# Altium project BeagleBone-AI.PrjPcb (part 5 of 5)
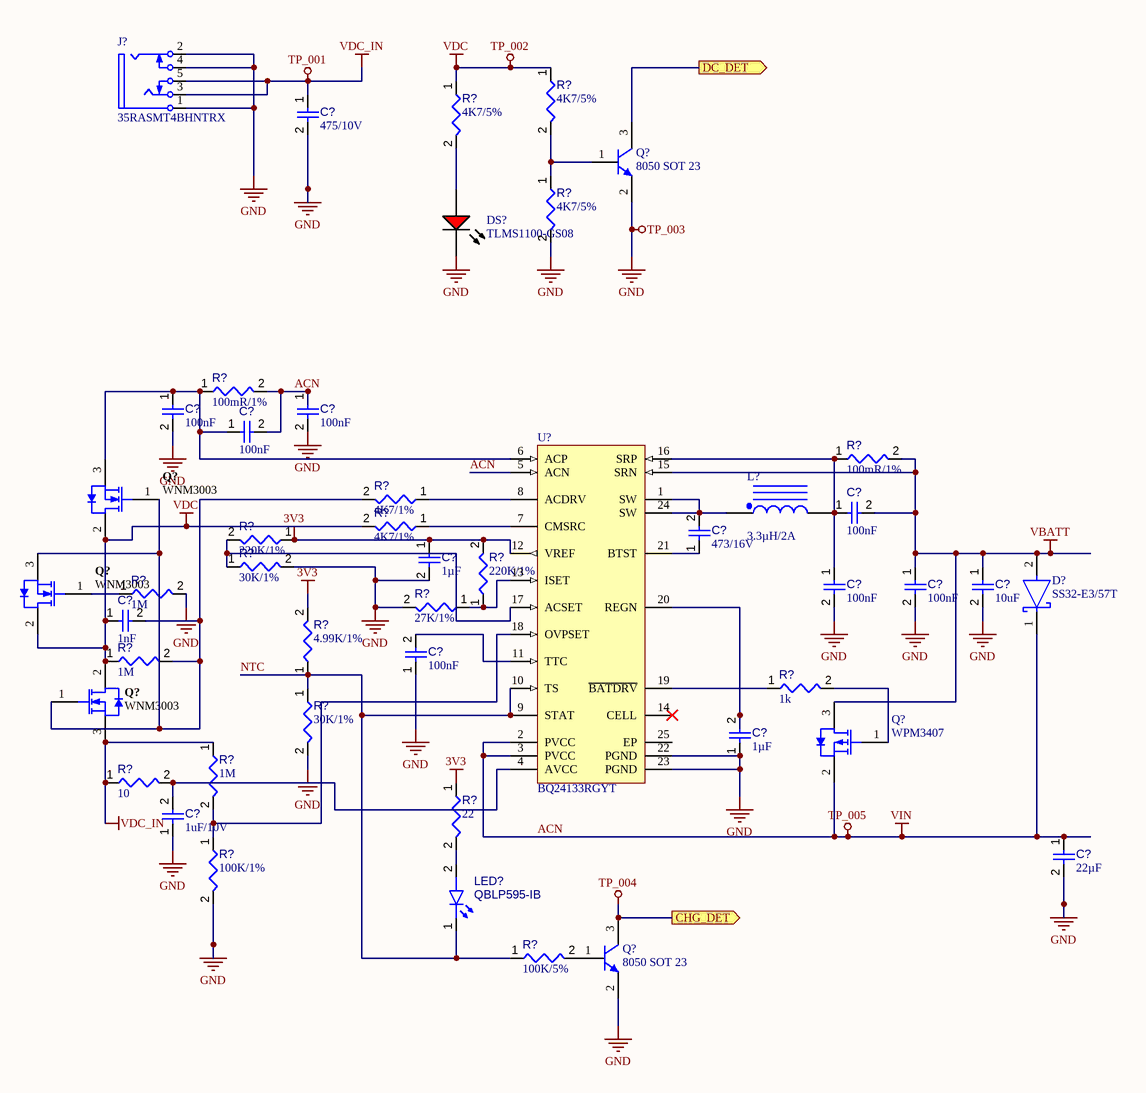
[diagram p24: BMS_Circuit.SchDoc]

## Nets that join several sheets
1V8_PHY_HDMI: 12 Processor  Power (U4.Y17), 13 Processor Power Deco (C159.1)
1V8_PHY_LDO3: 03 PMIC1 (C121.1 U3.K11), 13 Processor Power Deco (FL1.1)
1V8_PHY_LDO4: 03 PMIC1 (C117.1 U3.K12), 13 Processor Power Deco (FB6.1)
1V8_PHY_PCIE: 12 Processor  Power (U4.AA16 U4.AA17 U4.W14), 13 Processor Power Deco (C116.1 C149.1 FB6.2)
1V8_PHY_SATA: 12 Processor  Power (U4.V13), 13 Processor Power Deco (C184.1)
1V8_PHY_USB: 12 Processor  Power (U4.AA13 U4.AB12 U4.W12), 13 Processor Power Deco (C37.1 C163.1 FL1.3)
1V8_PLL: 03 PMIC1 (C157.1 U3.B5), 12 Processor  Power (C123.1 U4.AD16 U4.AE16), 13 Processor Power Deco (FL2.1)
1V8_PLLA: 12 Processor  Power (U4.M14 U4.N16 U4.R14 U4.R17), 13 Processor Power Deco (5 pins)
1V8_PLLB: 12 Processor  Power (5 pins), 13 Processor Power Deco (C189.1)
3V3: GPS_NEO (11 pins), BMS_Circuit (6 pins)
3V3_SD: 03 PMIC1 (C151.1 U3.C6), 04 PMIC2 (Q1.2 R8.1 R9.1), 12 Processor  Power (C492.1 U4.W8 U4.Y8), 18 ADC_TF_Debug (7 pins)
3V3_USB: 03 PMIC1 (C134.1 U3.B9), 12 Processor  Power (C148.1 U4.AA12 U4.Y12)
DDR1_RST: 03 PMIC1 (65 pins), 04 PMIC2 (45 pins), 05 AM572x SYSTEM (29 pins), 06 DDR PART1 (80 pins), 07 DDR PART2 (5 pins), 08 DDR VTT_LEDs (33 pins), 09 MMC_UBOOT (31 pins), 10 AM572x Interface 1 (R112.2 R119.2 R189.2), 12 Processor  Power (126 pins), 13 Processor Power Deco (57 pins), 14 Exp Conn (9 pins), 15 WIFI (21 pins), 16 Ethernet (32 pins), 17 USB Type C (38 pins), 18 ADC_TF_Debug (19 pins), 19 HDMI (18 pins), PMIC REGULATORS (35 pins), GPS_NEO (18 pins), BMS_Circuit (25 pins)
DDR_VREFSTL: 06 DDR PART1 (9 pins), 07 DDR PART2 (C209.1 U4.N22), 08 DDR VTT_LEDs (C8.1 U1.6)
GND_EARTH: 04 PMIC2 (MH1.1 MH2.1 MH3.1 MH4.1), 16 Ethernet (J37.15 J37.16 R640.2), 17 USB Type C (7 pins), 18 ADC_TF_Debug (J90.10 J90.11 J90.12 J90.13), 19 HDMI (J91.20 J91.21 J91.22 J91.23)
VDD_1V8: 03 PMIC1 (C152.1 U3.B6), 04 PMIC2 (6 pins), 09 MMC_UBOOT (R702.1), 12 Processor  Power (34 pins)
VDD_3V3: 03 PMIC1 (5 pins), 04 PMIC2 (6 pins), 05 AM572x SYSTEM (14 pins), 08 DDR VTT_LEDs (10 pins), 09 MMC_UBOOT (15 pins), 10 AM572x Interface 1 (R24.2 R134.2 R180.1 R192.1), 11 AM572x Interface 2 (R173.1), 12 Processor  Power (39 pins), 13 Processor Power Deco (13 pins), 14 Exp Conn (p9.3 p9.4), 15 WIFI (13 pins), 16 Ethernet (13 pins), 17 USB Type C (12 pins), 18 ADC_TF_Debug (6 pins), 19 HDMI (7 pins)
VDD_5V: 03 PMIC1 (15 pins), 04 PMIC2 (33 pins), 14 Exp Conn (D82.2 p9.7 p9.8), 17 USB Type C (6 pins), 18 ADC_TF_Debug (C489.1 U40.1), 19 HDMI (C497.1 U12.14)
VDD_ADC: 14 Exp Conn (p9.32), 18 ADC_TF_Debug (C490.1 R656.2 U40.5)
VDD_CAPE_5V: 14 Exp Conn (D82.1 p9.5 p9.6), 19 HDMI (Q19.1)
VDD_CORE: 04 PMIC2 (C266.1 C297.1 L20.2 U3.B1), 12 Processor  Power (25 pins), 13 Processor Power Deco (12 pins)
VDD_DDR: 04 PMIC2 (C94.1 C295.1 L16.2 U3.K13), 06 DDR PART1 (56 pins), 07 DDR PART2 (R672.1 R673.1 R674.1 R675.1), 08 DDR VTT_LEDs (10 pins), 12 Processor  Power (38 pins)
VDD_DSPEVE: 04 PMIC2 (5 pins), 12 Processor  Power (12 pins), 13 Processor Power Deco (9 pins)
VDD_EMMC: 09 MMC_UBOOT (15 pins), 12 Processor  Power (C496.1 U4.J8 U4.K8)
VDD_GPU: 04 PMIC2 (C264.1 L19.2 U3.K6), 12 Processor  Power (8 pins), 13 Processor Power Deco (6 pins)
VDD_IVA: 04 PMIC2 (C93.1 C296.1 L21.2 U3.L11), 12 Processor  Power (U4.U18 U4.U19 U4.V18 U4.V19), 13 Processor Power Deco (C110.1 C175.1 C181.1)
VDD_MPU: 04 PMIC2 (5 pins), 12 Processor  Power (16 pins), 13 Processor Power Deco (13 pins)
VDD_TYPE C: 17 USB Type C (6 pins), 19 HDMI (Q19.2)
AIN0: 14 Exp Conn (p9.39), 18 ADC_TF_Debug (U78.13)
AIN1: 14 Exp Conn (p9.40), 18 ADC_TF_Debug (U78.16)
AIN2: 14 Exp Conn (p9.37), 18 ADC_TF_Debug (U78.1)
AIN3: 14 Exp Conn (p9.38), 18 ADC_TF_Debug (U78.15)
AIN4: 14 Exp Conn (p9.33), 18 ADC_TF_Debug (U78.12)
AIN5: 14 Exp Conn (p9.36), 18 ADC_TF_Debug (U78.11)
AIN6: 14 Exp Conn (p9.35), 18 ADC_TF_Debug (U78.8)
DDR1_A0: 06 DDR PART1 (U2.N3 U4.AD20 U11.N3), 08 DDR VTT_LEDs (R36.1)
DDR1_A1: 06 DDR PART1 (U2.P7 U4.AC19 U11.P7), 08 DDR VTT_LEDs (R137.1)
DDR1_A2: 06 DDR PART1 (U2.P3 U4.AC20 U11.P3), 08 DDR VTT_LEDs (R37.1)
DDR1_A3: 06 DDR PART1 (U2.N2 U4.AB19 U11.N2), 08 DDR VTT_LEDs (R39.1)
DDR1_A4: 06 DDR PART1 (U2.P8 U4.AF21 U11.P8), 08 DDR VTT_LEDs (R136.1)
DDR1_A5: 06 DDR PART1 (U2.P2 U4.AH22 U11.P2), 08 DDR VTT_LEDs (R43.1)
DDR1_A6: 06 DDR PART1 (U2.R8 U4.AG23 U11.R8), 08 DDR VTT_LEDs (R131.1)
DDR1_A7: 06 DDR PART1 (U2.R2 U4.AE21 U11.R2), 08 DDR VTT_LEDs (r160.1)
DDR1_A8: 06 DDR PART1 (U2.T8 U4.AF22 U11.T8), 08 DDR VTT_LEDs (R123.1)
DDR1_A9: 06 DDR PART1 (U2.R3 U4.AE22 U11.R3), 08 DDR VTT_LEDs (R40.1)
DDR1_A10: 06 DDR PART1 (U2.L7 U4.AD21 U11.L7), 08 DDR VTT_LEDs (R125.1)
DDR1_A11: 06 DDR PART1 (U2.R7 U4.AD22 U11.R7), 08 DDR VTT_LEDs (R31.1)
DDR1_A12: 06 DDR PART1 (U2.N7 U4.AC21 U11.N7), 08 DDR VTT_LEDs (R132.1)
DDR1_A13: 06 DDR PART1 (U2.T3 U4.AF18 U11.T3), 08 DDR VTT_LEDs (R142.1)
DDR1_A14: 06 DDR PART1 (U2.T7 U4.AE17 U11.T7), 08 DDR VTT_LEDs (R128.1)
DDR1_A15: 06 DDR PART1 (U2.M7 U4.AD18 U11.M7), 08 DDR VTT_LEDs (R30.1)
DDR1_BA0: 06 DDR PART1 (U2.M2 U4.AF17 U11.M2), 08 DDR VTT_LEDs (R33.1)
DDR1_BA1: 06 DDR PART1 (U2.N8 U4.AE18 U11.N8), 08 DDR VTT_LEDs (R34.1)
DDR1_BA2: 06 DDR PART1 (U2.M3 U4.AB18 U11.M3), 08 DDR VTT_LEDs (R42.1)
DDR1_CASN: 06 DDR PART1 (U2.K3 U4.AC18 U11.K3), 08 DDR VTT_LEDs (R140.1)
DDR1_CKE: 06 DDR PART1 (U2.K9 U4.AG22 U11.K9), 08 DDR VTT_LEDs (R126.1)
DDR1_CLK0: 06 DDR PART1 (U2.J7 U4.AG24 U11.J7), 08 DDR VTT_LEDs (R26.1)
DDR1_CLK0N: 06 DDR PART1 (U2.K7 U4.AH24 U11.K7), 08 DDR VTT_LEDs (R29.1)
DDR1_CSN0: 06 DDR PART1 (U2.L2 U4.AH23 U11.L2), 08 DDR VTT_LEDs (R129.1)
DDR1_ODT0: 06 DDR PART1 (U2.K1 U4.AE20 U11.K1), 08 DDR VTT_LEDs (R161.1)
DDR1_RASN: 06 DDR PART1 (U2.J3 U4.AF20 U11.J3), 08 DDR VTT_LEDs (R25.1)
DDR1_WEN: 06 DDR PART1 (U2.L3 U4.AH21 U11.L3), 08 DDR VTT_LEDs (R143.1)
GPMC_AD0: 09 MMC_UBOOT (R596.1 R692.2), 11 AM572x Interface 2 (U4.M6)
GPMC_AD1: 09 MMC_UBOOT (R597.1 R689.2), 11 AM572x Interface 2 (U4.M2)
GPMC_AD2: 09 MMC_UBOOT (R598.1 R693.2), 11 AM572x Interface 2 (U4.L5)
GPMC_AD3: 09 MMC_UBOOT (R38.2 R493.1), 11 AM572x Interface 2 (U4.M1)
GPMC_AD4: 09 MMC_UBOOT (R164.2 R690.1), 11 AM572x Interface 2 (U4.L6)
GPMC_AD5: 09 MMC_UBOOT (R162.2 R691.1), 11 AM572x Interface 2 (U4.L4)
GPMC_AD6: 09 MMC_UBOOT (R599.1), 11 AM572x Interface 2 (U4.L3)
GPMC_AD7: 09 MMC_UBOOT (R600.1), 11 AM572x Interface 2 (U4.L2)
GPMC_AD8: 09 MMC_UBOOT (R44.2), 11 AM572x Interface 2 (U4.L1)
GPMC_AD9: 09 MMC_UBOOT (R601.1), 11 AM572x Interface 2 (U4.K2)
GPMC_AD10: 09 MMC_UBOOT (R602.1), 11 AM572x Interface 2 (U4.J1)
GPMC_AD11: 09 MMC_UBOOT (R603.1), 11 AM572x Interface 2 (U4.J2)
GPMC_AD12: 09 MMC_UBOOT (R604.1), 11 AM572x Interface 2 (U4.H1)
GPMC_AD13: 09 MMC_UBOOT (R605.1), 11 AM572x Interface 2 (U4.J3)
GPMC_AD14: 09 MMC_UBOOT (R606.1), 11 AM572x Interface 2 (U4.H2)
GPMC_AD15: 09 MMC_UBOOT (R168.2), 11 AM572x Interface 2 (U4.H3)
I2C1_SCL: 03 PMIC1 (R148.1 R149.1), 05 AM572x SYSTEM (R193.1 U4.C20), 17 USB Type C (R542.2), 18 ADC_TF_Debug (R706.1)
I2C1_SDA: 03 PMIC1 (R145.1 R146.1), 05 AM572x SYSTEM (R194.1 U4.C21), 17 USB Type C (R543.2), 18 ADC_TF_Debug (R707.1)
JTAG_EMU0: 05 AM572x SYSTEM (p2.13), 10 AM572x Interface 1 (R192.2 U4.G21)
JTAG_EMU1: 05 AM572x SYSTEM (p2.14), 10 AM572x Interface 1 (R180.2 U4.D24)
JTAG_RTCK: 05 AM572x SYSTEM (p2.9), 10 AM572x Interface 1 (R199.2)
JTAG_TCK: 05 AM572x SYSTEM (p2.11), 10 AM572x Interface 1 (R200.2)
JTAG_TDI: 05 AM572x SYSTEM (p2.3), 10 AM572x Interface 1 (U4.D23)
JTAG_TDO: 05 AM572x SYSTEM (p2.7), 10 AM572x Interface 1 (U4.F19)
JTAG_TMS: 05 AM572x SYSTEM (p2.1), 10 AM572x Interface 1 (U4.F18)
JTAG_TRSTn: 05 AM572x SYSTEM (p2.2), 10 AM572x Interface 1 (R189.1 U4.D20)
MCLK: 10 AM572x Interface 1 (R24.1 U4.V1), 16 Ethernet (R470.1)
MDIO: 10 AM572x Interface 1 (R134.1 U4.U4), 16 Ethernet (R469.1)
MII0_INT: 10 AM572x Interface 1 (U4.Y1), 16 Ethernet (R475.1 U45.20)
MII0_RESETn: 05 AM572x SYSTEM (R641.1), 16 Ethernet (5 pins)
NetC473_1: 09 MMC_UBOOT (R583.2), 18 ADC_TF_Debug (C473.1 J90.5 R421.2)
NetD79_2: 10 AM572x Interface 1 (U4.AF11), 17 USB Type C (D79.2 J41.2)
NetD79_3: 10 AM572x Interface 1 (U4.AE11), 17 USB Type C (D79.3 J41.3)
NetJ90_1: 09 MMC_UBOOT (U4.AA5), 18 ADC_TF_Debug (J90.1 R418.2)
NetJ90_2: 09 MMC_UBOOT (U4.Y3), 18 ADC_TF_Debug (J90.2 R419.2)
NetJ90_3: 09 MMC_UBOOT (U4.Y6), 18 ADC_TF_Debug (J90.3 R420.2)
NetJ90_7: 09 MMC_UBOOT (U4.AA6), 18 ADC_TF_Debug (J90.7 R422.2)
NetJ90_8: 09 MMC_UBOOT (U4.Y4), 18 ADC_TF_Debug (J90.8 R423.2)
NetJ90_9: 09 MMC_UBOOT (U4.W7), 18 ADC_TF_Debug (J90.9 R424.2)
Netp8_3: 09 MMC_UBOOT (U4.AB8), 14 Exp Conn (p8.3)
Netp8_4: 09 MMC_UBOOT (U4.AB5), 14 Exp Conn (p8.4)
Netp8_5: 09 MMC_UBOOT (U4.AC9), 14 Exp Conn (p8.5)
Netp8_6: 09 MMC_UBOOT (U4.AC3), 14 Exp Conn (p8.6)
Netp8_7: 10 AM572x Interface 1 (U4.G14), 14 Exp Conn (p8.7)
Netp8_8: 10 AM572x Interface 1 (U4.F14), 14 Exp Conn (p8.8)
Netp8_9: 09 MMC_UBOOT (U4.E17), 14 Exp Conn (p8.9)
Netp8_10: 10 AM572x Interface 1 (U4.A13), 14 Exp Conn (p8.10)
Netp8_11: 11 AM572x Interface 2 (U4.AH4), 14 Exp Conn (p8.11)
Netp8_12: 11 AM572x Interface 2 (U4.AG6), 14 Exp Conn (p8.12)
Netp8_13: 11 AM572x Interface 2 (U4.D3), 14 Exp Conn (p8.13)
Netp8_14: 10 AM572x Interface 1 (U4.D5), 14 Exp Conn (p8.14)
Netp8_16: 10 AM572x Interface 1 (U4.B4), 14 Exp Conn (p8.16)
Netp8_17: 11 AM572x Interface 2 (U4.A7), 14 Exp Conn (p8.17)
Netp8_18: 11 AM572x Interface 2 (U4.F5), 14 Exp Conn (p8.18)
Netp8_19: 11 AM572x Interface 2 (U4.E6), 14 Exp Conn (p8.19)
Netp8_20: 09 MMC_UBOOT (U4.AC4), 14 Exp Conn (p8.20)
Netp8_21: 09 MMC_UBOOT (R585.2), 14 Exp Conn (p8.21)
Netp8_22: 09 MMC_UBOOT (U4.AD6), 14 Exp Conn (p8.22)
Netp8_23: 09 MMC_UBOOT (U4.AC8), 14 Exp Conn (p8.23)
Netp8_24: 09 MMC_UBOOT (U4.AC6), 14 Exp Conn (p8.24)
Netp8_25: 09 MMC_UBOOT (U4.AC7), 14 Exp Conn (p8.25)
Netp8_26: 10 AM572x Interface 1 (U4.B3), 14 Exp Conn (p8.26)
Netp8_39: 11 AM572x Interface 2 (U4.F8), 14 Exp Conn (p8.39)
Netp8_40: 11 AM572x Interface 2 (U4.E7), 14 Exp Conn (p8.40)
Netp8_41: 11 AM572x Interface 2 (U4.E9), 14 Exp Conn (p8.41)
Netp8_42: 11 AM572x Interface 2 (U4.F9), 14 Exp Conn (p8.42)
Netp8_43: 11 AM572x Interface 2 (U4.F10), 14 Exp Conn (p8.43)
Netp8_44: 11 AM572x Interface 2 (U4.G11), 14 Exp Conn (p8.44)
Netp9_10: 05 AM572x SYSTEM (R55.2), 14 Exp Conn (p9.10)
Netp9_12: 11 AM572x Interface 2 (U4.B14), 14 Exp Conn (p9.12)
Netp9_13: 09 MMC_UBOOT (U4.C17), 14 Exp Conn (p9.13)
Netp9_14: 10 AM572x Interface 1 (U4.D6), 14 Exp Conn (p9.14)
Netp9_15: 11 AM572x Interface 2 (U4.AG4), 14 Exp Conn (p9.15)
Netp9_16: 10 AM572x Interface 1 (U4.C5), 14 Exp Conn (p9.16)
Netp9_23: 11 AM572x Interface 2 (U4.A22), 14 Exp Conn (p9.23)
Netp9_24: 11 AM572x Interface 2 (U4.F20), 14 Exp Conn (p9.24)
Netp9_25: 09 MMC_UBOOT (R584.2), 14 Exp Conn (p9.25)
Netp9_28: 10 AM572x Interface 1 (U4.A12), 14 Exp Conn (p9.28)
Netp9_30: 10 AM572x Interface 1 (U4.B13), 14 Exp Conn (p9.30)
NetQ17_1: 11 AM572x Interface 2 (U4.AD3), 18 ADC_TF_Debug (Q17.1 R659.2)
NetQ18_1: 08 DDR VTT_LEDs (Q18.1 R700.1), 11 AM572x Interface 2 (U4.AH6)
NetR56_1: 05 AM572x SYSTEM (R56.1), 09 MMC_UBOOT (U7.K5)
NetR57_2: 03 PMIC1 (R159.1), 05 AM572x SYSTEM (R57.2 R58.1)
NetR92_2: 10 AM572x Interface 1 (R92.2), 16 Ethernet (U45.34)
NetR93_2: 10 AM572x Interface 1 (R93.2), 16 Ethernet (U45.35)
NetR94_2: 10 AM572x Interface 1 (R94.2), 16 Ethernet (U45.36)
NetR95_2: 10 AM572x Interface 1 (R95.2), 16 Ethernet (U45.37)
NetR96_2: 10 AM572x Interface 1 (R96.2), 16 Ethernet (U45.32)
NetR97_2: 10 AM572x Interface 1 (R97.2), 16 Ethernet (U45.33)
NetR112_1: 10 AM572x Interface 1 (R112.1 U4.AC10), 17 USB Type C (U48.4)
NetR124_1: 03 PMIC1 (R124.1 U3.G6), 05 AM572x SYSTEM (U6.1)
NetR152_2: 03 PMIC1 (R152.2), 11 AM572x Interface 2 (U4.F21)
NetR173_2: 11 AM572x Interface 2 (R173.2 U4.B27), 18 ADC_TF_Debug (U46.6)
NetR333_1: 10 AM572x Interface 1 (U4.D27), 15 WIFI (R333.1)
NetR334_1: 10 AM572x Interface 1 (U4.C28), 15 WIFI (R334.1)
NetR336_1: 10 AM572x Interface 1 (U4.D28), 15 WIFI (R336.1)
NetR337_1: 10 AM572x Interface 1 (U4.D26), 15 WIFI (R337.1)
NetR387_1: 08 DDR VTT_LEDs (R387.1 T1.2), 11 AM572x Interface 2 (U4.AG3)
NetR389_1: 08 DDR VTT_LEDs (R389.1 T1.5), 11 AM572x Interface 2 (U4.AG5)
NetR390_1: 08 DDR VTT_LEDs (R390.1 T2.2), 11 AM572x Interface 2 (U4.J11)
NetR392_1: 08 DDR VTT_LEDs (R392.1 T2.5), 11 AM572x Interface 2 (U4.AF6)
NetR409_2: 10 AM572x Interface 1 (U4.B20), 19 HDMI (R409.2 U12.3)
NetR413_2: 11 AM572x Interface 2 (U4.R5), 15 WIFI (R413.2 U37.41)
NetR458_1: 10 AM572x Interface 1 (U4.W2), 16 Ethernet (R458.1)
NetR459_1: 10 AM572x Interface 1 (U4.Y2), 16 Ethernet (R459.1)
NetR460_1: 10 AM572x Interface 1 (U4.V3), 16 Ethernet (R460.1)
NetR462_1: 10 AM572x Interface 1 (U4.V4), 16 Ethernet (R462.1)
NetR464_1: 10 AM572x Interface 1 (U4.V5), 16 Ethernet (R464.1)
NetR466_1: 10 AM572x Interface 1 (U4.U5), 16 Ethernet (R466.1)
NetR516_1: 10 AM572x Interface 1 (U4.V2), 17 USB Type C (R516.1 U48.5)
NetR530_2: 10 AM572x Interface 1 (U4.C25), 19 HDMI (R530.2 U12.4)
NetR531_2: 10 AM572x Interface 1 (U4.F17), 19 HDMI (R531.2 U12.5)
NetR545_1: 11 AM572x Interface 2 (U4.AE6), 17 USB Type C (R545.1 U22.6)
NetR546_2: 11 AM572x Interface 2 (U4.AG2), 17 USB Type C (R546.2 U22.9)
NetR560_2: 11 AM572x Interface 2 (U4.P5), 15 WIFI (R560.2 U37.44)
NetR567_2: 11 AM572x Interface 2 (U4.AG8), 18 ADC_TF_Debug (R567.2 U78.2)
NetR577_1: 10 AM572x Interface 1 (U4.E14), 14 Exp Conn (R577.1)
NetR578_1: 10 AM572x Interface 1 (U4.C2), 14 Exp Conn (R578.1)
NetR579_1: 11 AM572x Interface 2 (U4.C23), 14 Exp Conn (R579.1)
NetR580_2: 11 AM572x Interface 2 (U4.C1), 14 Exp Conn (R580.2)
NetR581_1: 11 AM572x Interface 2 (R581.1), 15 WIFI (U37.16)
NetR582_1: 11 AM572x Interface 2 (R582.1), 15 WIFI (U37.17)
NetR607_2: 10 AM572x Interface 1 (R607.2), 15 WIFI (U37.28)
NetR608_2: 10 AM572x Interface 1 (R608.2), 15 WIFI (U37.26)
NetR609_2: 11 AM572x Interface 2 (R609.2), 15 WIFI (U37.27)
NetR610_2: 11 AM572x Interface 2 (U4.A15), 15 WIFI (R610.2)
NetR614_1: 11 AM572x Interface 2 (U4.C6), 14 Exp Conn (R614.1)
NetR615_1: 11 AM572x Interface 2 (U4.AF9), 14 Exp Conn (R615.1)
NetR616_1: 11 AM572x Interface 2 (U4.C7), 14 Exp Conn (R616.1)
NetR617_1: 10 AM572x Interface 1 (U4.D17), 14 Exp Conn (R617.1)
NetR618_2: 11 AM572x Interface 2 (U4.G16), 14 Exp Conn (R618.2)
NetR619_1: 11 AM572x Interface 2 (U4.C8), 14 Exp Conn (R619.1)
NetR620_1: 11 AM572x Interface 2 (U4.B10), 14 Exp Conn (R620.1)
NetR621_1: 11 AM572x Interface 2 (U4.B9), 14 Exp Conn (R621.1)
NetR622_1: 11 AM572x Interface 2 (U4.D11), 14 Exp Conn (R622.1)
NetR623_1: 11 AM572x Interface 2 (U4.C9), 14 Exp Conn (R623.1)
NetR624_2: 11 AM572x Interface 2 (U4.A9), 14 Exp Conn (R624.2)
NetR625_1: 11 AM572x Interface 2 (U4.C11), 14 Exp Conn (R625.1)
NetR626_1: 11 AM572x Interface 2 (U4.E8), 14 Exp Conn (R626.1)
NetR627_1: 10 AM572x Interface 1 (U4.A21), 14 Exp Conn (R627.1)
NetR628_1: 11 AM572x Interface 2 (U4.A5), 14 Exp Conn (R628.1)
NetR629_1: 11 AM572x Interface 2 (U4.AD9), 14 Exp Conn (R629.1)
NetR630_2: 10 AM572x Interface 1 (U4.C18), 14 Exp Conn (R630.2)
NetR631_1: 11 AM572x Interface 2 (U4.D9), 14 Exp Conn (R631.1)
NetR632_1: 11 AM572x Interface 2 (U4.B24), 14 Exp Conn (R632.1)
NetR633_1: 10 AM572x Interface 1 (U4.F12), 14 Exp Conn (R633.1)
NetR634_1: 11 AM572x Interface 2 (U4.R6), 14 Exp Conn (R634.1)
NetR635_1: 11 AM572x Interface 2 (U4.F4), 14 Exp Conn (R635.1)
NetR636_2: 10 AM572x Interface 1 (U4.G12), 14 Exp Conn (R636.2)
NetR637_1: 11 AM572x Interface 2 (U4.G17), 14 Exp Conn (R637.1)
NetR638_1: 11 AM572x Interface 2 (U4.T9), 14 Exp Conn (R638.1)
NetR639_1: 11 AM572x Interface 2 (U4.D2), 14 Exp Conn (R639.1)
NetR643_1: 10 AM572x Interface 1 (U4.A11), 14 Exp Conn (R643.1)
NetR644_1: 10 AM572x Interface 1 (U4.D14), 14 Exp Conn (R644.1)
NetR645_1: 10 AM572x Interface 1 (U4.B12), 14 Exp Conn (R645.1)
NetR646_1: 10 AM572x Interface 1 (U4.C14), 14 Exp Conn (R646.1)
NetR652_1: 11 AM572x Interface 2 (U4.E21), 14 Exp Conn (R652.1)
NetR653_1: 11 AM572x Interface 2 (U4.AE2), 14 Exp Conn (R653.1)
NetR662_1: 11 AM572x Interface 2 (U4.F11), 14 Exp Conn (R662.1)
NetR663_1: 11 AM572x Interface 2 (U4.B7), 14 Exp Conn (R663.1)
NetR664_1: 11 AM572x Interface 2 (U4.G10), 14 Exp Conn (R664.1)
NetR665_1: 11 AM572x Interface 2 (U4.A10), 14 Exp Conn (R665.1)
NetR666_1: 11 AM572x Interface 2 (U4.E11), 14 Exp Conn (R666.1)
NetR667_1: 11 AM572x Interface 2 (U4.A8), 14 Exp Conn (R667.1)
NetR668_1: 10 AM572x Interface 1 (U4.C3), 14 Exp Conn (R668.1)
NetR669_1: 11 AM572x Interface 2 (U4.J14), 14 Exp Conn (R669.1)
NetR680_2: 05 AM572x SYSTEM (R680.2), 16 Ethernet (U90.2)
NetR681_1: 11 AM572x Interface 2 (U4.D1), 14 Exp Conn (R681.1)
NetR682_1: 10 AM572x Interface 1 (U4.A3), 14 Exp Conn (R682.1)
NetR683_1: 11 AM572x Interface 2 (U4.D8), 14 Exp Conn (R683.1)
NetR684_1: 11 AM572x Interface 2 (U4.G6), 14 Exp Conn (R684.1)
NetR685_1: 11 AM572x Interface 2 (U4.D7), 14 Exp Conn (R685.1)
NetR686_1: 11 AM572x Interface 2 (U4.F2), 14 Exp Conn (R686.1)
NetR687_1: 09 MMC_UBOOT (U4.B19), 14 Exp Conn (R687.1)
NetR688_1: 11 AM572x Interface 2 (U4.B8), 14 Exp Conn (R688.1)
NetR694_1: 11 AM572x Interface 2 (U4.AF8), 14 Exp Conn (R694.1)
NetR695_1: 11 AM572x Interface 2 (U4.B22), 14 Exp Conn (R695.1)
NetR696_1: 11 AM572x Interface 2 (U4.B26), 14 Exp Conn (R696.1)
NetR697_1: 11 AM572x Interface 2 (U4.A26), 14 Exp Conn (R697.1)
NetR698_2: 11 AM572x Interface 2 (U4.N1), 16 Ethernet (R698.2)
NetR705_2: 10 AM572x Interface 1 (U4.B21), 19 HDMI (R705.2 U12.2)
NetU4_AC11: 10 AM572x Interface 1 (U4.AC11), 17 USB Type C (U72.2)
NetU4_AD11: 10 AM572x Interface 1 (U4.AD11), 17 USB Type C (U72.1)
NetU4_AE1: 11 AM572x Interface 2 (U4.AE1), 15 WIFI (U37.13)
NetU4_AE3: 11 AM572x Interface 2 (U4.AE3), 15 WIFI (U37.6)
NetU4_AE5: 11 AM572x Interface 2 (U4.AE5), 15 WIFI (U37.34)
NetU4_AE12: 10 AM572x Interface 1 (U4.AE12), 17 USB Type C (U72.4)
NetU4_AF1: 11 AM572x Interface 2 (U4.AF1), 15 WIFI (U37.7)
NetU4_AF3: 11 AM572x Interface 2 (U4.AF3), 15 WIFI (U37.12)
NetU4_AF12: 10 AM572x Interface 1 (U4.AF12), 17 USB Type C (U72.5)
NetU4_AG16: 10 AM572x Interface 1 (U4.AG16), 19 HDMI (U91.C3)
NetU4_AG17: 10 AM572x Interface 1 (U4.AG17), 19 HDMI (U91.C1)
NetU4_AG18: 10 AM572x Interface 1 (U4.AG18), 19 HDMI (U92.C3)
NetU4_AG19: 10 AM572x Interface 1 (U4.AG19), 19 HDMI (U92.C1)
NetU4_AH16: 10 AM572x Interface 1 (U4.AH16), 19 HDMI (U91.C4)
NetU4_AH17: 10 AM572x Interface 1 (U4.AH17), 19 HDMI (U91.C2)
NetU4_AH18: 10 AM572x Interface 1 (U4.AH18), 19 HDMI (U92.C4)
NetU4_AH19: 10 AM572x Interface 1 (U4.AH19), 19 HDMI (U92.C2)
NetU4_C26: 11 AM572x Interface 2 (U4.C26), 18 ADC_TF_Debug (U46.5)
NetU4_P6: 11 AM572x Interface 2 (U4.P6), 15 WIFI (U37.42)
NetU4_R9: 11 AM572x Interface 2 (U4.R9), 15 WIFI (U37.43)
PWR_BUT: 03 PMIC1 (C320.1 R589.1 S3.2 S3.4), 14 Exp Conn (p9.9)
TypeC_D+: 10 AM572x Interface 1 (U4.AD12), 17 USB Type C (D78.2 J42.A6 J42.B6)
TypeC_D-: 10 AM572x Interface 1 (U4.AC12), 17 USB Type C (D78.3 J42.A7 J42.B7)